# Altium schematic sheet PowerMiscelenaus.SchDoc
size A4; Author: Michał Kowalik; CompanyName: AGH Racing; DocumentNumber: 5; Revision: 2.1; SheetNumber: 5; SheetTotal: 11; CarNumber: 5; ProjectName: Project Name
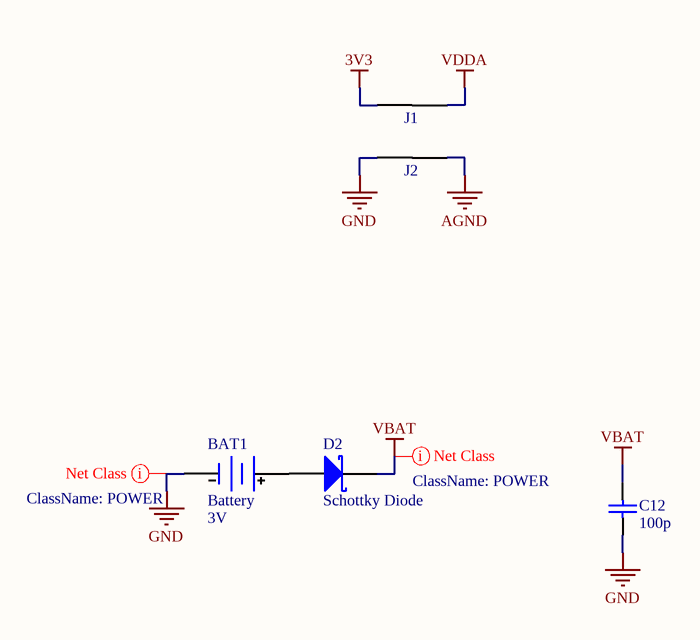
[diagram p0: PowerMiscelenaus.SchDoc]

## Parts
BAT1  Battery  value 3V  [KEYSTONE 1056]
C12  value 100p  [CAP_0603_IPC_MD]  (hidden comment: Cap)
D2  Schottky Diode  [MiniMELF_IPC_MD]
J1  NetTie  [NETTIE]  (value not drawn)  (net tie, no BOM)
J2  NetTie  [NETTIE]  (value not drawn)  (net tie, no BOM)

## Nets
3V3: J1.1
AGND: J2.2
GND: BAT1.2(-) C12.1 J2.1
VBAT: C12.2 D2.2(K)
VDDA: J1.2
NetBAT1_1: BAT1.1(+) D2.1(A)

## Layout directives
net class POWER: GND, VBAT

## Notes on the sheet
- Confidential / Not for distribution !
- Project name:
- Document name:
- Sheet:
- Car No.
- of
- Designer Name:
- Date/Time:
- Revision:

## Library data of the parts
BAT1 = BATT
C12 = Cap: Capacitor
D2 = Schottky Diode: Manufacturer: VISHAY; Manufacturer Part Number: LL42-GS08 (for MiniMELF); Supplier: TME